# EAGLE design ledshield_v1_michihito (EAGLE 7.1.0)
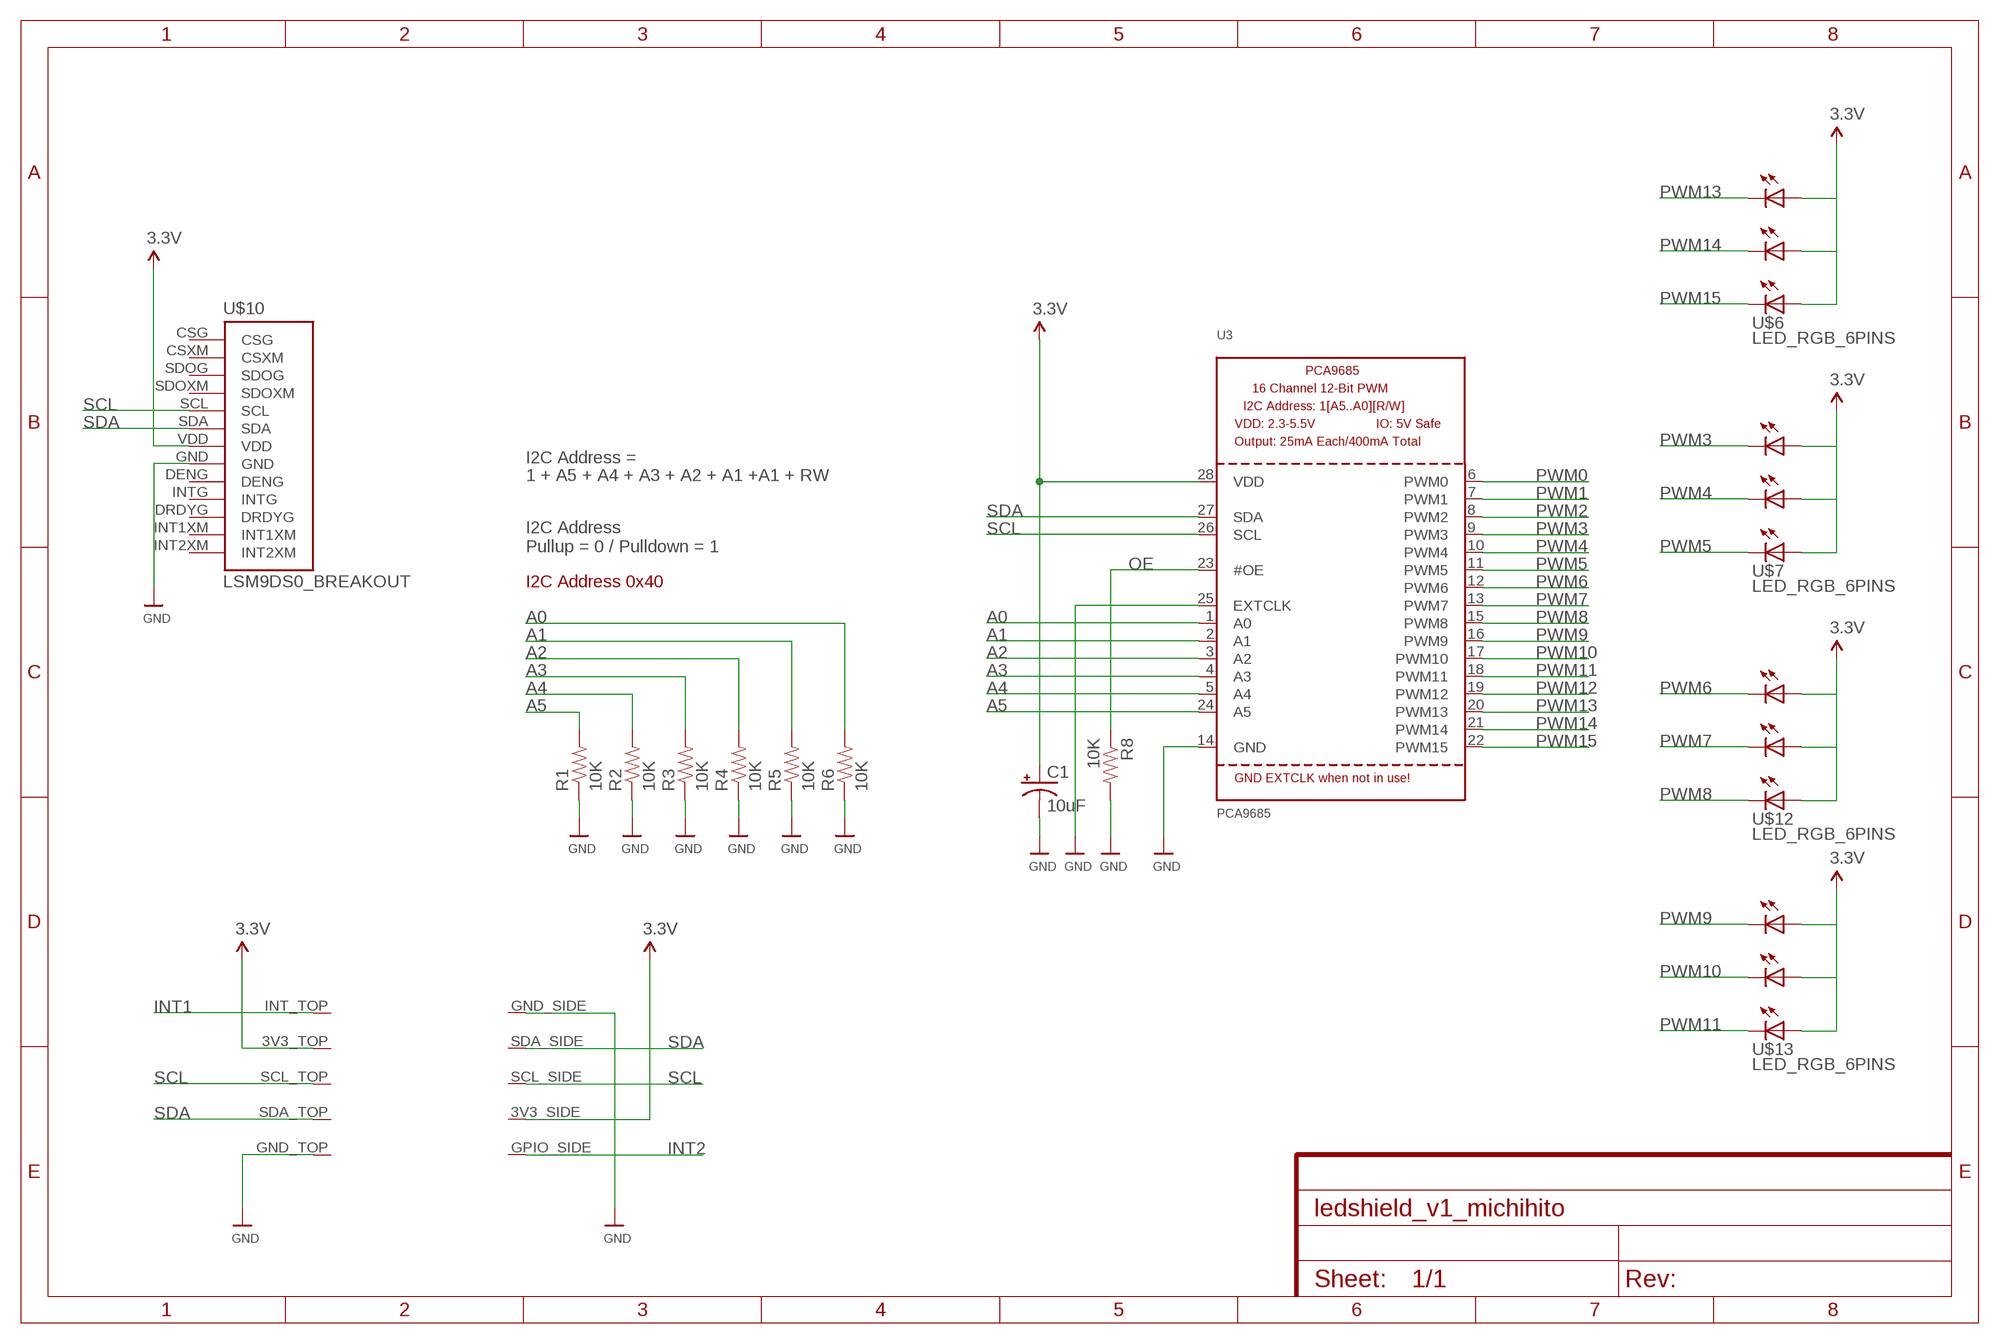
[diagram p0: schematic, sheet 1]

## Parts
C1  10uF  CAP_POL1206  [EIA3216]
R1  10K  RESISTOR1206  [1206]
R2  10K  RESISTOR1206  [1206]
R3  10K  RESISTOR1206  [1206]
R4  10K  RESISTOR1206  [1206]
R5  10K  RESISTOR1206  [1206]
R6  10K  RESISTOR1206  [1206]
R8  10K  RESISTOR1206  [1206]
U3  PCA9685  [TSSOP28]
U$1  IOT_MODULE_MAIN_V2_PTH  [IOT_MODULE_MAIN_V3_PTH]
U$6  LED_RGB_6PINS  [LED_RGB_6PINS]
U$7  LED_RGB_6PINS  [LED_RGB_6PINS]
U$10  LSM9DS0_BREAKOUT  [LSM9DS0_BREAKOUT]
U$12  LED_RGB_6PINS  [LED_RGB_6PINS]
U$13  LED_RGB_6PINS  [LED_RGB_6PINS]

## Nets
3.3V: C1.A(+) U3.28(VDD) U$1.3V3_SIDE U$1.3V3_TOP U$6.BA U$6.GA U$6.RA U$7.BA U$7.GA U$7.RA U$10.VDD U$12.BA U$12.GA U$12.RA U$13.BA U$13.GA U$13.RA
A0: R6.2 U3.1(A0)
A1: R5.2 U3.2(A1)
A2: R4.2 U3.3(A2)
A3: R3.2 U3.4(A3)
A4: R2.2 U3.5(A4)
A5: R1.2 U3.24(A5)
GND: C1.C(-) R1.1 R2.1 R3.1 R4.1 R5.1 R6.1 R8.2 U3.14(GND) U3.25(EXTCLK) U$1.GND_SIDE U$1.GND_TOP U$10.GND
INT1: U$1.INT_TOP
INT2: U$1.GPIO_SIDE
OE: R8.1 U3.23(#OE)
PWM0: U3.6(PWM0)
PWM1: U3.7(PWM1)
PWM2: U3.8(PWM2)
PWM3: U3.9(PWM3) U$7.BC
PWM4: U3.10(PWM4) U$7.RC
PWM5: U3.11(PWM5) U$7.GC
PWM6: U3.12(PWM6) U$12.BC
PWM7: U3.13(PWM7) U$12.RC
PWM8: U3.15(PWM8) U$12.GC
PWM9: U3.16(PWM9) U$13.BC
PWM10: U3.17(PWM10) U$13.RC
PWM11: U3.18(PWM11) U$13.GC
PWM12: U3.19(PWM12)
PWM13: U3.20(PWM13) U$6.BC
PWM14: U3.21(PWM14) U$6.RC
PWM15: U3.22(PWM15) U$6.GC
SCL: U3.26(SCL) U$1.SCL_SIDE U$1.SCL_TOP U$10.SCL
SDA: U3.27(SDA) U$1.SDA_SIDE U$1.SDA_TOP U$10.SDA
Unconnected: U$10.CSG U$10.CSXM U$10.DENG U$10.DRDYG U$10.INT1XM U$10.INT2XM U$10.INTG U$10.SDOG U$10.SDOXM

## Notes on the sheet
- I2C Address =
- 1 + A5 + A4 + A3 + A2 + A1 +A1 + RW
- I2C Address
  Pullup = 0 / Pulldown = 1
- I2C Address 0x40

## Library data of the parts
C1 = SparkFun-Passives:CAP_POL: Capacitor Polarized These are standard SMD and PTH capacitors. Normally 10uF, 47uF, and 100uF in electrolytic and tantalum varieties. Always verify the external diameter of the through hole cap, it varies with capacity, voltage, and manufacturer. The EIA devices should be standard.
R1-R6 R8 = SparkFun-Resistors:RESISTOR: Resistor Basic schematic elements and footprints for 0603, 1206, and PTH resistors.
U3 = microbuilder:PCA9685: PCA9685 - 16 Channel 12-Bit I2C PWM Controller 5.0V tolerant 16 channel, 12-bit I2C PWM controller with 25mA per output (max. 400mA total) Digikey: 568-5931-1-ND
U$1 = Mlab_ProEx2015:IOT_MODULE_MAIN_V2
U$6 U$7 U$12 U$13 = Mlab_ProEx2015:LED_RGB_6PINS
U$10 = Mlab_ProEx2015:LSM9DS0_BREAKOUT

## Board
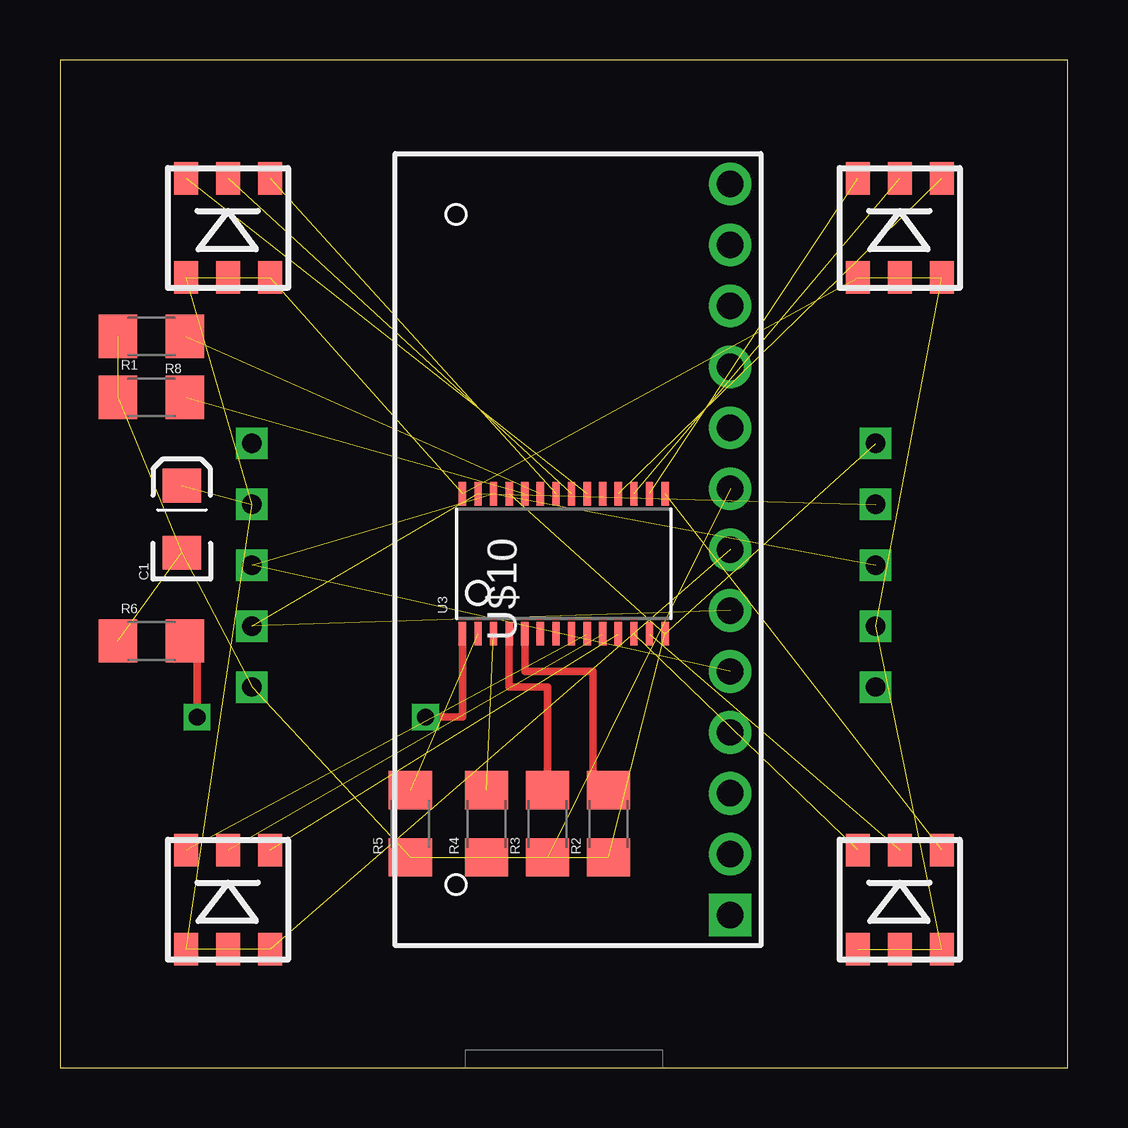
[diagram p1: board, top side]
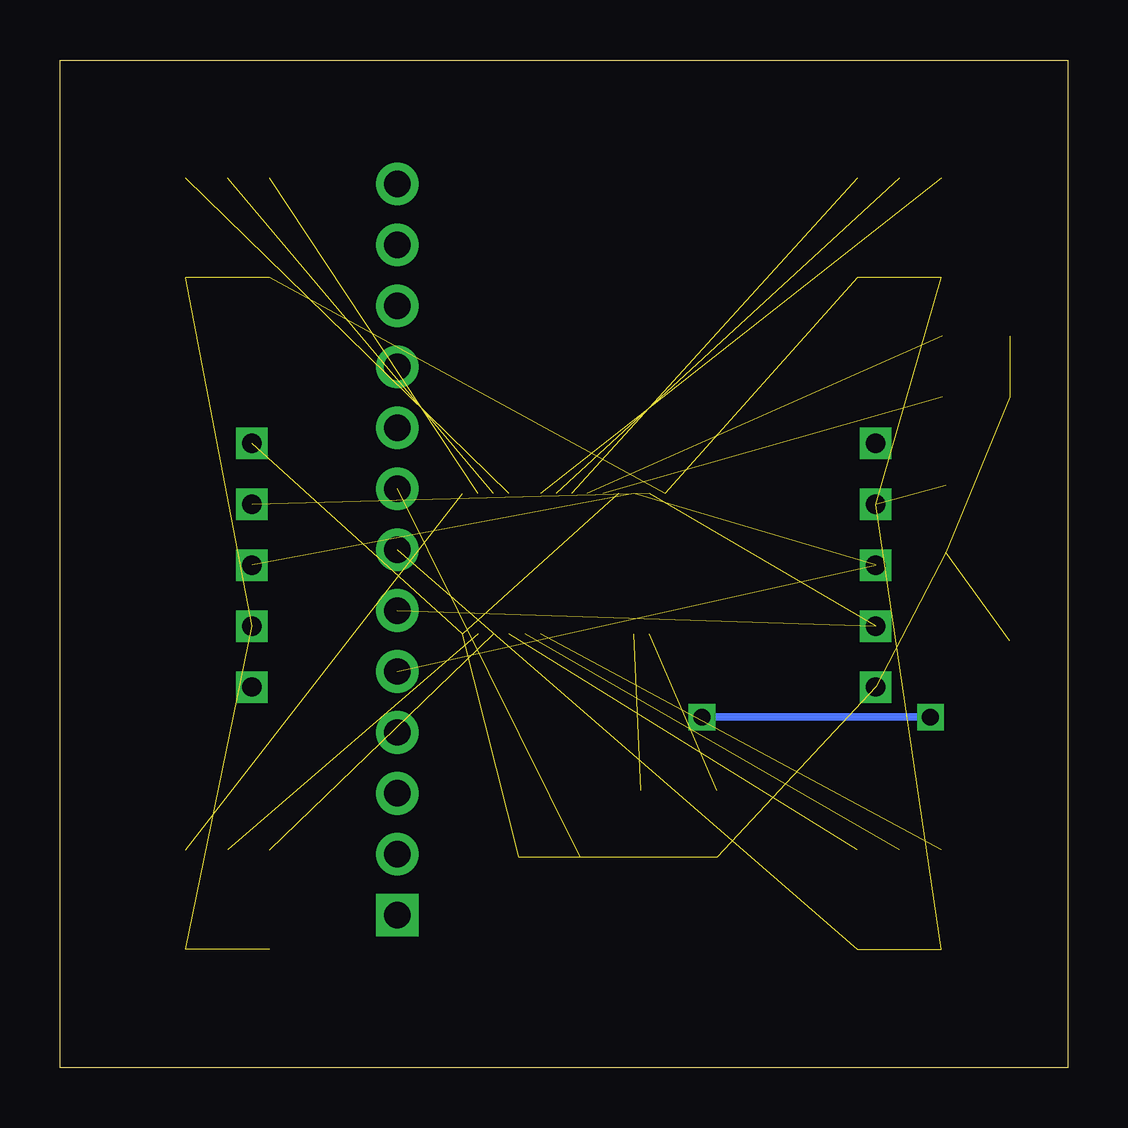
[diagram p2: board, bottom side, seen from below]

Size 42 x 42 mm. Coordinates in mm from the lower left corner, seen from the top.
Outline: 0,0 42,0 42,42 0,42 0,0
Copper layers (1*16): Top 0.035mm / dielectric 1.5mm / Bottom 0.035mm
Design rules "default": minimum track width 10mil, minimum drill 24mil, track to track 8mil, track to pad 8mil, pad to pad 8mil, via to via 8mil, smd to smd 8mil, copper to edge 40mil, drill to drill 8mil, minimum pad ring 10mil, minimum via ring 8mil, stop-mask expansion 4mil, vias tented up to drill 0mil, thermal gap 10mil

### Footprints (pad centres in the part's own frame; a part is rotated, then mirrored left to right if it is on the bottom)
EIA3216 = smd 1.4 x 1.6: A 1.4,0; C -1.4,0
1206 = smd 1.6 x 1.8: 1 -1.4,0; 2 1.4,0
TSSOP28 = smd 0.305 x 0.991: 1 -4.225,-2.918; 2 -3.575,-2.918; 3 -2.925,-2.918; 4 -2.275,-2.918; 5 -1.625,-2.918; 6 -0.975,-2.918; 7 -0.325,-2.918; 8 0.325,-2.918; 9 0.975,-2.918; 10 1.625,-2.918; 11 2.275,-2.918; 12 2.925,-2.918; 13 3.575,-2.918; 14 4.225,-2.918; 15 4.225,2.918; 16 3.575,2.918; 17 2.925,2.918; 18 2.275,2.918; 19 1.625,2.918; 20 0.975,2.918; 21 0.325,2.918; 22 -0.325,2.918; 23 -0.975,2.918; 24 -1.625,2.918; 25 -2.275,2.918; 26 -2.925,2.918; 27 -3.575,2.918; 28 -4.225,2.918
IOT_MODULE_MAIN_V3_PTH = drill 0.8 square: 3V3_SIDE 13,-2.601; 3V3_TOP -13,2.479; GND_SIDE 13,5.019; GND_TOP -13,-5.141; GPIO_SIDE 13,-5.141; INT_TOP -13,5.019; SCL_SIDE 13,-0.061; SCL_TOP -13,-0.061; SDA_SIDE 13,2.479; SDA_TOP -13,-2.601
LED_RGB_6PINS = smd 1 x 1.35: BA -1.749,-2.07; BC -1.749,2.07; GA 1.751,-2.07; GC 1.751,2.07; RA 0.001,-2.07; RC 0.001,2.07
LSM9DS0_BREAKOUT = drill 1.1 pad 1.778 square: CSG -15.24,-2.54 | drill 1.1 pad 1.778: CSXM -12.7,-2.54; DENG 5.08,-2.54; DRDYG 10.16,-2.54; GND 2.54,-2.54; INT1XM 12.7,-2.54; INT2XM 15.24,-2.54; INTG 7.62,-2.54; SCL -5.08,-2.54; SDA -2.54,-2.54; SDOG -10.16,-2.54; SDOXM -7.62,-2.54; VDD 0,-2.54

### Placement (x,y rotation side)
C1  5.08,22.86 90 top
R1  3.81,27.94 0 top
R2  22.86,10.16 90 top
R3  20.32,10.16 90 top
R4  17.78,10.16 90 top
R5  14.61,10.16 90 top
R6  3.81,17.78 0 top
R8  3.81,30.48 180 top
U3  21,21 0 top
U$1  21,21 0 top
U$6  7,35 0 top
U$7  7,7 0 top
U$10  25.4,21.59 90 top
U$12  35,7 0 top
U$13  35,35 0 top

### Tracks (layer width: path | path; a pad name or v marks a point on that pad's centre or on a via)
3.3V  (16 unrouted)
A0  (via drill 0.7)
  Top 0.305: R6.2 5.71,17.78 v5.71,14.61 | v15.24,14.61 16.77,14.61 U3.1
  Bottom 0.305: v5.71,14.61 v15.24,14.61
A1  (1 unrouted)
A2  (1 unrouted)
A3
  Top 0.305: R3.2 20.32,15.88 18.73,15.88 U3.4
A4
  Top 0.305: R2.2 22.23,11.56 22.23,16.51 19.38,16.51 U3.5
A5  (1 unrouted)
GND  (12 unrouted)
OE  (1 unrouted)
PWM3  (1 unrouted)
PWM4  (1 unrouted)
PWM5  (1 unrouted)
PWM6  (1 unrouted)
PWM7  (1 unrouted)
PWM8  (1 unrouted)
PWM9  (1 unrouted)
PWM10  (1 unrouted)
PWM11  (1 unrouted)
PWM13  (1 unrouted)
PWM14  (1 unrouted)
PWM15  (1 unrouted)
SCL  (3 unrouted)
SDA  (3 unrouted)